# Altium schematic sheet Memory.SchDoc
size A4; Revision: B.2(PCB.SCH)
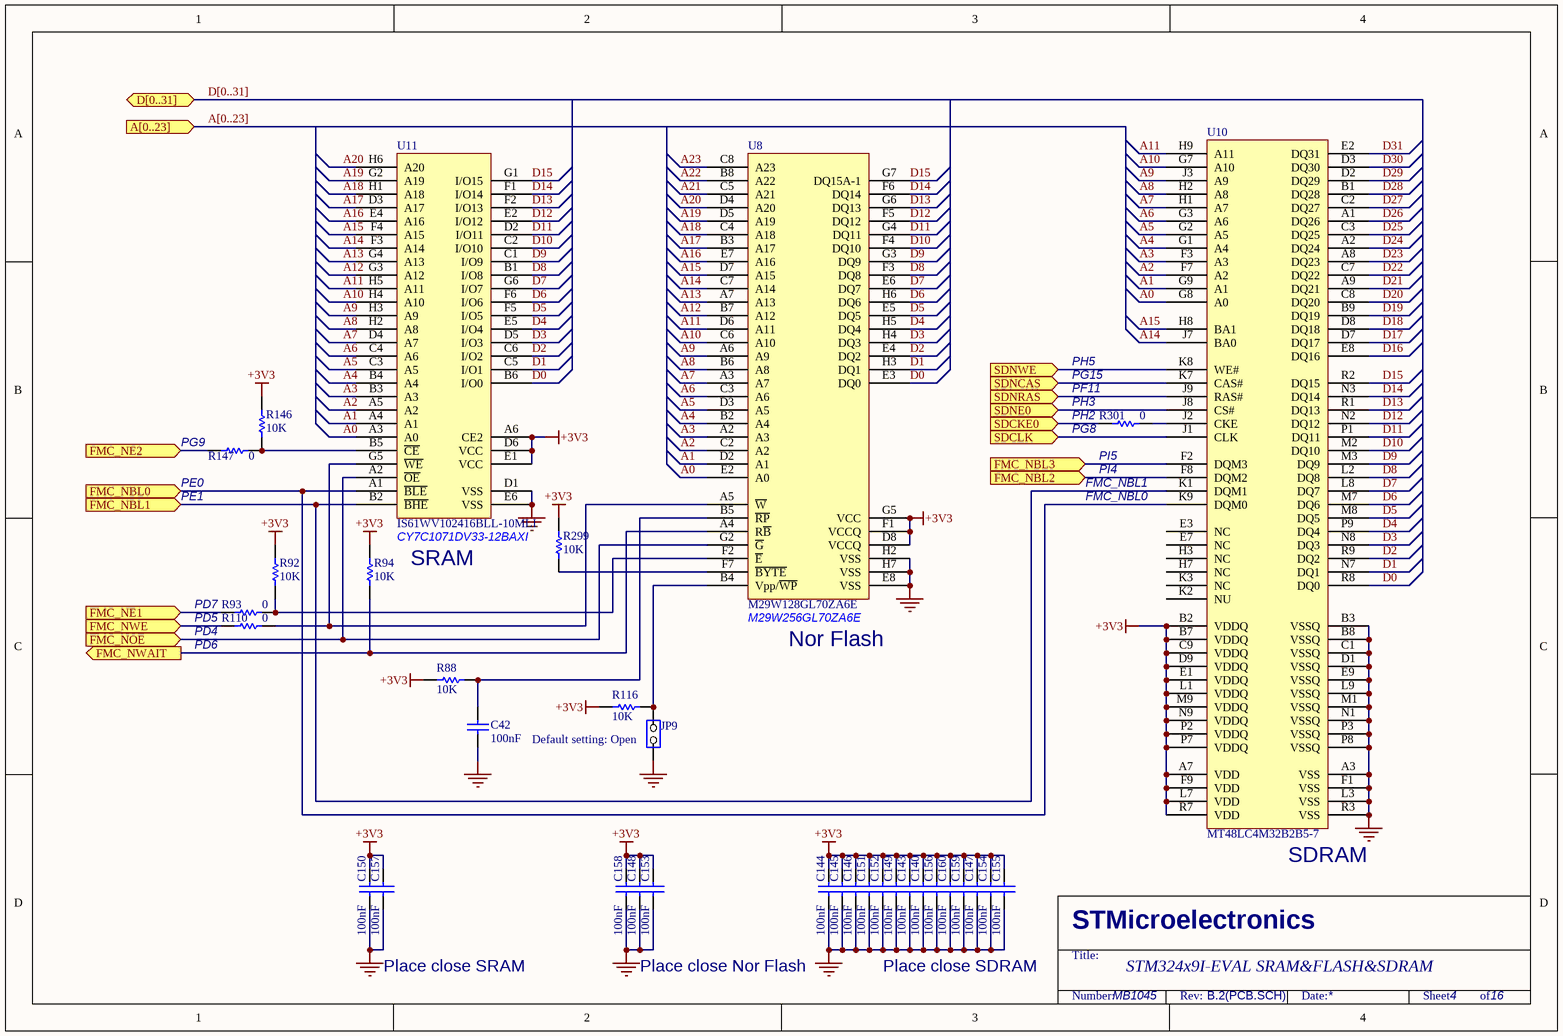
[diagram p0: Memory.SchDoc]

## Parts
C42  100nF  [0603C]
C140  100nF  [0603C]
C143  100nF  [0603C]
C144  100nF  [0603C]
C145  100nF  [0603C]
C146  100nF  [0603C]
C147  100nF  [0603C]
C148  100nF  [0603C]
C149  100nF  [0603C]
C150  100nF  [0603C]
C151  100nF  [0603C]
C152  100nF  [0603C]
C153  100nF  [0603C]
C154  100nF  [0603C]
C155  100nF  [0603C]
C156  100nF  [0603C]
C157  100nF  [0603C]
C158  100nF  [0603C]
C159  100nF  [0603C]
C160  100nF  [0603C]
JP9  (no value)  [SIP2]
R88  10K  [0603R]
R92  10K  [0603R]
R93  0  [0603R]
R94  10K  [0603R]
R110  0  [0603R]
R116  10K  [0603R]
R146  10K  [0603R]
R147  0  [0603R]
R299  10K  [0603R]
R301  0  [0603R]
U8  M29W128GL70ZA6E  [BGA64_1_10X13]
U10  MT48LC4M32B2B5-7  [FBGA90_0R8_8X13]
U11  IS61WV102416BLL-10MLI  [BGA48_0R75_9X11]

## Ports
A[0..23] (in), D[0..31] (bidir), FMC_NBL0 (in), FMC_NBL1 (in), FMC_NBL2 (in), FMC_NBL3 (in), FMC_NE1 (in), FMC_NE2 (in), FMC_NOE (in), FMC_NWAIT (out), FMC_NWE (in), SDCKE0 (in), SDCLK (in), SDNCAS (in), SDNE0 (in), SDNRAS (in), SDNWE (in)

## Nets
+3V3: C140.1 C143.1 C144.1 C145.1 C146.1 C147.1 C148.1 C149.1 C150.1 C151.1 C152.1 C153.1 C154.1 C155.1 C156.1 C157.1 C158.1 C159.1 C160.1 R88.1 R92.2 R94.2 R116.2 R146.2 R299.2 U8.D8(VCCQ) U8.F1(VCCQ) U8.G5(VCC) U10.A7(VDD) U10.B2(VDDQ) U10.B7(VDDQ) U10.C9(VDDQ) U10.D9(VDDQ) U10.E1(VDDQ) U10.F9(VDD) U10.L1(VDDQ) U10.L7(VDD) U10.M9(VDDQ) U10.N9(VDDQ) U10.P2(VDDQ) U10.P7(VDDQ) U10.R7(VDD) U11.A6(CE2) U11.D6(VCC) U11.E1(VCC)
GND: C42.2 C140.2 C143.2 C144.2 C145.2 C146.2 C147.2 C148.2 C149.2 C150.2 C151.2 C152.2 C153.2 C154.2 C155.2 C156.2 C157.2 C158.2 C159.2 C160.2 JP9.1(COMMON) U8.E8(VSS) U8.H2(VSS) U8.H7(VSS) U10.A3(VSS) U10.B3(VSSQ) U10.B8(VSSQ) U10.C1(VSSQ) U10.D1(VSSQ) U10.E9(VSSQ) U10.F1(VSS) U10.L3(VSS) U10.L9(VSSQ) U10.M1(VSSQ) U10.N1(VSSQ) U10.P3(VSSQ) U10.P8(VSSQ) U10.R3(VSS) U11.D1(VSS) U11.E6(VSS)
A0: U8.E2(A0) U10.G8(A0) U11.A3(A0)
A1: U8.D2(A1) U10.G9(A1) U11.A4(A1)
A2: U8.C2(A2) U10.F7(A2) U11.A5(A2)
A3: U8.A2(A3) U10.F3(A3) U11.B3(A3)
A4: U8.B2(A4) U10.G1(A4) U11.B4(A4)
A5: U8.D3(A5) U10.G2(A5) U11.C3(A5)
A6: U8.C3(A6) U10.G3(A6) U11.C4(A6)
A7: U8.A3(A7) U10.H1(A7) U11.D4(A7)
A8: U8.B6(A8) U10.H2(A8) U11.H2(A8)
A9: U8.A6(A9) U10.J3(A9) U11.H3(A9)
A10: U8.C6(A10) U10.G7(A10) U11.H4(A10)
A11: U8.D6(A11) U10.H9(A11) U11.H5(A11)
A12: U8.B7(A12) U11.G3(A12)
A13: U8.A7(A13) U11.G4(A13)
A14: U8.C7(A14) U10.J7(BA0) U11.F3(A14)
A15: U8.D7(A15) U10.H8(BA1) U11.F4(A15)
A16: U8.E7(A16) U11.E4(A16)
A17: U8.B3(A17) U11.D3(A17)
A18: U8.C4(A18) U11.H1(A18)
A19: U8.D5(A19) U11.G2(A19)
A20: U8.D4(A20) U11.H6(A20)
A21: U8.C5(A21)
A22: U8.B8(A22)
A23: U8.C8(A23)
D0: U8.E3(DQ0) U10.R8(DQ0) U11.B6(I/O0)
D1: U8.H3(DQ1) U10.N7(DQ1) U11.C5(I/O1)
D2: U8.E4(DQ2) U10.R9(DQ2) U11.C6(I/O2)
D3: U8.H4(DQ3) U10.N8(DQ3) U11.D5(I/O3)
D4: U8.H5(DQ4) U10.P9(DQ4) U11.E5(I/O4)
D5: U8.E5(DQ5) U10.M8(DQ5) U11.F5(I/O5)
D6: U8.H6(DQ6) U10.M7(DQ6) U11.F6(I/O6)
D7: U8.E6(DQ7) U10.L8(DQ7) U11.G6(I/O7)
D8: U8.F3(DQ8) U10.L2(DQ8) U11.B1(I/O8)
D9: U8.G3(DQ9) U10.M3(DQ9) U11.C1(I/O9)
D10: U8.F4(DQ10) U10.M2(DQ10) U11.C2(I/O10)
D11: U8.G4(DQ11) U10.P1(DQ11) U11.D2(I/O11)
D12: U8.F5(DQ12) U10.N2(DQ12) U11.E2(I/O12)
D13: U8.G6(DQ13) U10.R1(DQ13) U11.F2(I/O13)
D14: U8.F6(DQ14) U10.N3(DQ14) U11.F1(I/O14)
D15: U8.G7(DQ15A-1) U10.R2(DQ15) U11.G1(I/O15)
D16: U10.E8(DQ16)
D17: U10.D7(DQ17)
D18: U10.D8(DQ18)
D19: U10.B9(DQ19)
D20: U10.C8(DQ20)
D21: U10.A9(DQ21)
D22: U10.C7(DQ22)
D23: U10.A8(DQ23)
D24: U10.A2(DQ24)
D25: U10.C3(DQ25)
D26: U10.A1(DQ26)
D27: U10.C2(DQ27)
D28: U10.B1(DQ28)
D29: U10.D2(DQ29)
D30: U10.D3(DQ30)
D31: U10.E2(DQ31)
FMC_NBL0: U10.K9(DQM0) U11.A1(~{BLE}) ; port FMC_NBL0
FMC_NBL1: U10.K1(DQM1) U11.B2(~{BHE}) ; port FMC_NBL1
FMC_NBL2: U10.F8(DQM2) ; port FMC_NBL2
FMC_NBL3: U10.F2(DQM3) ; port FMC_NBL3
FMC_NE1: R93.2 ; port FMC_NE1
FMC_NE2: R147.2 ; port FMC_NE2
FMC_NOE: U8.G2(~{G}) U11.A2(~{OE}) ; port FMC_NOE
FMC_NWAIT: R94.1 U8.A4(R~{B}) ; port FMC_NWAIT
FMC_NWE: R110.2 ; port FMC_NWE
SDCKE0: R301.2 ; port SDCKE0
SDCLK: U10.J1(CLK) ; port SDCLK
SDNCAS: U10.K7(CAS#) ; port SDNCAS
SDNE0: U10.J8(CS#) ; port SDNE0
SDNRAS: U10.J9(RAS#) ; port SDNRAS
SDNWE: U10.K8(WE#) ; port SDNWE
NetC42_1: C42.1 R88.2 U8.B5(~{RP})
NetJP9_2: JP9.2(NO) R116.1 U8.B4(Vpp/~{WP})
NetR92_1: R92.1 R93.1 U8.F2(~{E})
NetR110_1: R110.1 U8.A5(~{W}) U11.G5(~{WE})
NetR146_1: R146.1 R147.1 U11.B5(~{CE})
NetR299_1: R299.1 U8.F7(~{BYTE})
NetR301_1: R301.1 U10.J2(CKE)

Not connected (* = marked no-connect by the designer): U10 E3(NC) E7(NC) H3(NC) H7(NC) K2(NU) K3(NC)

## Buses and harness runs
bus A[0..23] = port A[0..23]
bus D[0..31] = port D[0..31]

## Notes on the sheet
- PH5
- (near R301) PG15
- (near R147) PG9
- (near R301) PF11
- (near R301) PH3
- (near R301) PH2
- (near R301) PG8
- (near R147) PE1
- (near R147) PE0
- FMC_NBL1
- FMC_NBL0
- (near R301) PI5
- (near R301) PI4
- CY7C1071DV33-12BAXI
- SRAM
- PD5
- PD7
- PD6
- PD4
- (near U8) M29W256GL70ZA6E
- (near U8) Nor Flash
- (near JP9) Default setting: Open
- (near U10) SDRAM
- Place close SRAM
- Place close Nor Flash
- Place close SDRAM
- STM324x9I-EVAL SRAM&FLASH&SDRAM
- MB1045
- 4
- 16
- STMicroelectronics
- Title:
- Number:
- Rev:
- Date:
- Sheet          of

## Library data of the parts
C42 C140 C143-C160 = Cap: Capacitor; Value: 10nF; Published: 8-Jun-2000; Revision: July-2002: Re-released for DXP Platform.; Publisher: Altium Limited
JP9 = JP2
R88 R92-R94 R110 R116 R146 R147 R299 R301 = Res1: Resistor; Value: 1K; Published: 8-Jun-2000; Revision: July-2002: Re-released for DXP Platform.; Publisher: Altium Limited
U8 = M29W128FL70ZA6E
U10 = MT48LC4M32B2B5